# Altium schematic sheet 19.SchDoc
size 297 x 209 mm
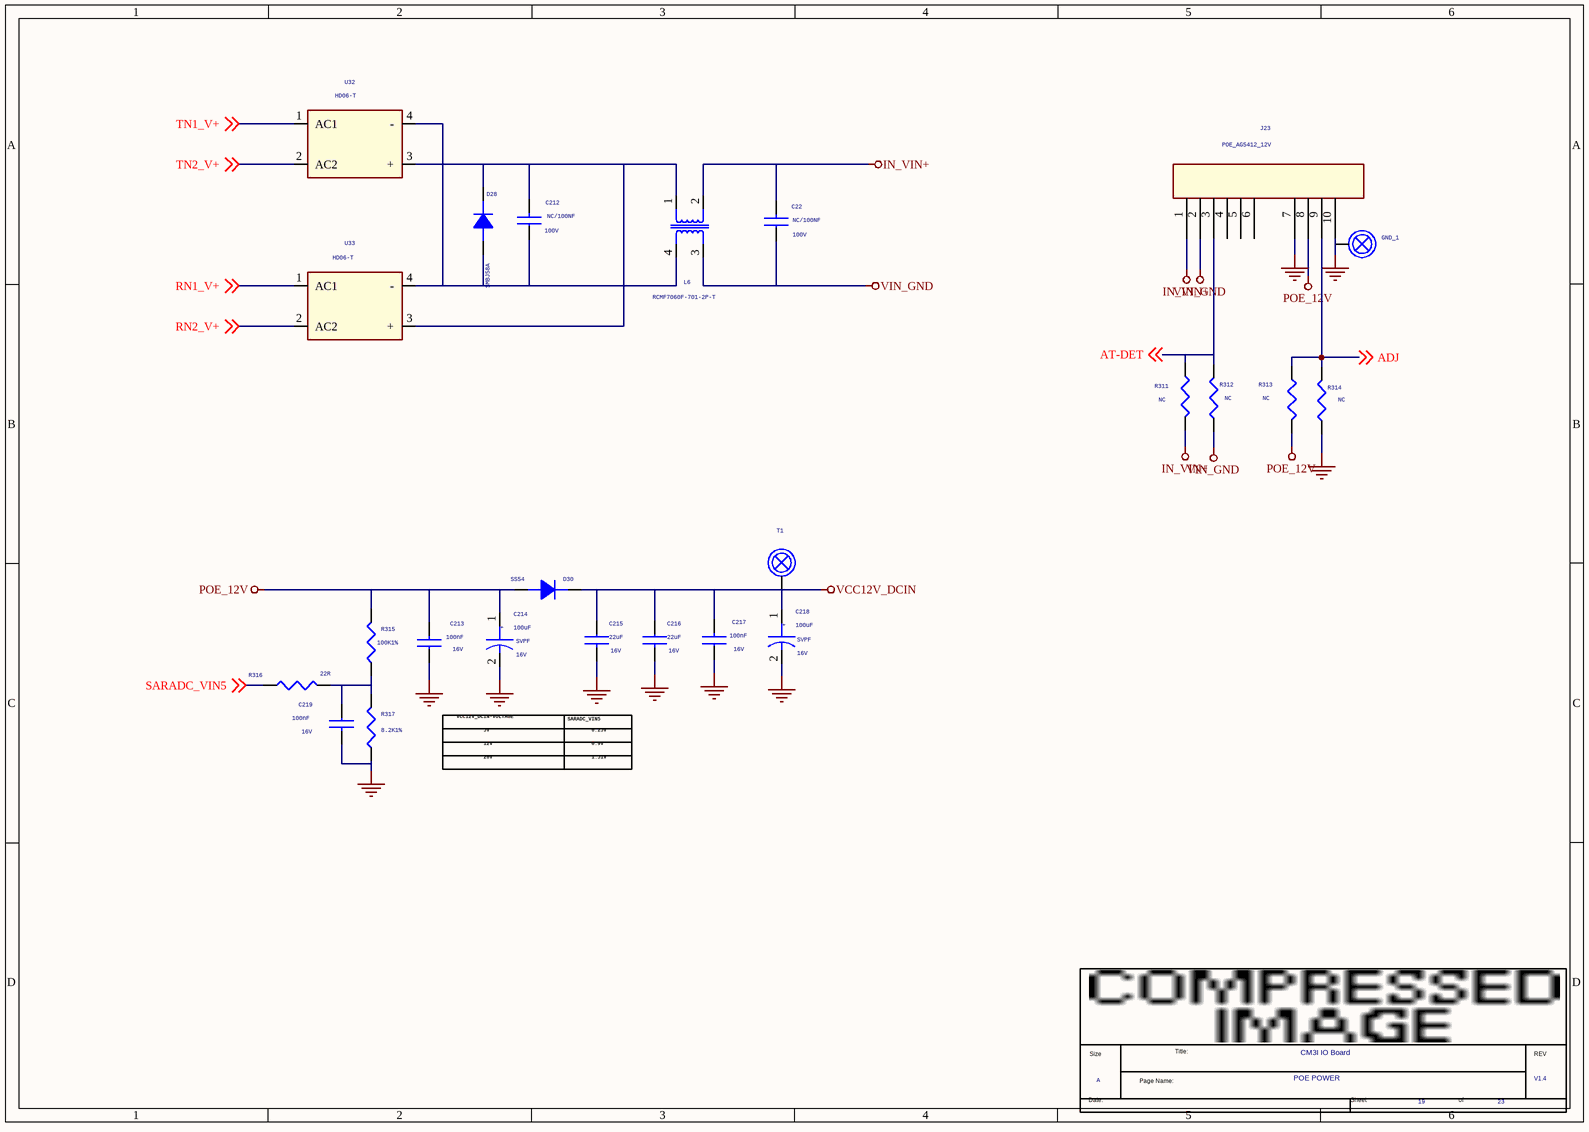
[diagram p0: 19.SchDoc]

## Parts
*  Page Count: 23  Page Number: 19  Page Size: A  Title: CM3I IO Board  RevCode: V1.4  Doc: POE POWER  (hidden comment: radxa_1010)  (graphical)
C22  NC/100NF  Voltage: 100V  [C0603]
C212  NC/100NF  Voltage: 100V  [C0603]
C213  100nF  Voltage: 16V  [C0402]
C214  100uF  Dielectric: SVPF  Voltage: 16V  [CAP_SM_6D3X7D7_1]
C215  22uF  Voltage: 16V  [C0805]
C216  22uF  Voltage: 16V  [C0805]
C217  100nF  Voltage: 16V  [C0402]
C218  100uF  Dielectric: SVPF  Voltage: 16V  [CAP_SM_6D3X7D7_1]
C219  100nF  Voltage: 16V  [C0402]
D28  SMBJ58A  [DO_214AA]
D30  SS54  [DO_214AC]
GND_1  GND  [TP32]  (value not drawn)
J23  POE_AG5412_12V  [DIP_POE_AG5412]
L6  RCMF7060F-701-2P-T  [RCMF7060]
R311  NC  [R0402]
R312  NC  [R0402]
R313  NC  [R0402]
R314  NC  [R0402]
R315  100K1%  [R0402]
R316  22R  [R0402]
R317  8.2K1%  [R0402]
T1  12V  [TP32]  (value not drawn)
U32  HD06-T  [SOP4_1D27_4]
U33  HD06-T  [SOP4_1D27_4]

## Nets
GND: C213.1 C214.2 C215.2 C216.2 C217.1 C218.2 C219.2 GND_1.1 J23.7(-VDC) J23.10(-VDC) R314.2 R317.1
IN_VIN+: C22.2 J23.1(VIN+) L6.2(R4) R311.2
POE_12V: C213.2 C214.1 D30.1(A) J23.8(+VDC) R313.2 R315.2
VCC12V_DCIN: C215.1 C216.1 C217.2 C218.1 D30.2(K) T1.1
VIN_GND: C22.1 J23.2(VIN-) L6.3(R3) R312.2
ADJ: J23.9(ADJ) R313.1 R314.1 ; off-sheet ADJ
AT-DET: J23.3(AT-DET) R311.1 R312.1 ; off-sheet AT-DET
RN1_V+: U33.1(AC1) ; off-sheet RN1_V+
RN2_V+: U33.2(AC2) ; off-sheet RN2_V+
SARADC_VIN5: R316.1 ; off-sheet SARADC_VIN5
TN1_V+: U32.1(AC1) ; off-sheet TN1_V+
TN2_V+: U32.2(AC2) ; off-sheet TN2_V+
NetC212_1: C212.1 D28.1(ANODE) L6.4(R2) U32.4(-) U33.4(-)
NetC212_2: C212.2 D28.2(CATHODE) L6.1(R1) U32.3(+) U33.3(+)
NetC219_1: C219.1 R315.1 R316.2 R317.2

Not connected (* = marked no-connect by the designer): J23 4 5 6

## Notes on the sheet
- VCC12V_DCIN-VOLTAGE
- 5V
- 12V
- SARADC_VIN5
- 0.25V
- 0.9V
- 20V
- 1.51V
- (in symbol CAP) +
- (in symbol radxa_1010) Title:; Size; REV; Page Name:; Date:; Sheet; of

## Library data of the parts
C22 = CAP NP_0: cap,10.00uF,+/-10%,6.3V,X5R,C0603; Manufacturer: TDK; RK PN: C1608X5R0J106K080AB; Priority: A; Tolerance: 10%; Dielectric: X5R; Part Type: C0402; Manufacturer PN: C1608X5R0J106K080AB; Created by: JJJ
C212 = CAP NP_0: cap,10.00uF,+/-10%,6.3V,X5R,C0603; Manufacturer PN: C1608X5R0J106K080AB; Manufacturer: TDK; Tolerance: 10%; Priority: A; Dielectric: X5R; Created by: JJJ; Part Type: C0402; RK PN: C1608X5R0J106K080AB
C213 = CAP NP_0: cap,1.00uF,+/-10%,10V,X5R,C0402; Manufacturer: TDK; RK PN: C1005X5R1A105K050BB; Priority: A; Tolerance: 10%; Dielectric: X5R; Part Type: C0402; Manufacturer PN: C1005X5R1A105K050BB; Created by: JJJ
C214 = CAP: 47uF,25V,30mR,SVPF; Manufacturer: Panasonic; RK PN: 25SVPF47M; Priority: A; Tolerance: 20%; Part Type: CAP_SM_6D3X7D7_1; Manufacturer PN: 25SVPF47M; Created by: JJJ
C215 = CAP NP_0: cap,22.00uF,+/-10%,10V,X5R,C0805; Manufacturer PN: C2012X5R1A226K125AB; Manufacturer: TDK; Tolerance: 10%; Priority: A; Dielectric: X5R; Created by: JJJ; Part Type: C0805; RK PN: C2012X5R1A226K125AB
C216 = CAP NP_0: cap,22.00uF,+/-10%,10V,X5R,C0805; Manufacturer: TDK; RK PN: C2012X5R1A226K125AB; Priority: A; Tolerance: 10%; Dielectric: X5R; Part Type: C0805; Manufacturer PN: C2012X5R1A226K125AB; Created by: JJJ
C217 = CAP NP_0: cap,1.00uF,+/-10%,10V,X5R,C0402; Manufacturer PN: C1005X5R1A105K050BB; Manufacturer: TDK; Tolerance: 10%; Priority: A; Dielectric: X5R; Created by: JJJ; Part Type: C0402; RK PN: C1005X5R1A105K050BB
C218 = CAP: 47uF,25V,30mR,SVPF; Manufacturer PN: 25SVPF47M; Manufacturer: Panasonic; Tolerance: 20%; Priority: A; Created by: JJJ; Part Type: CAP_SM_6D3X7D7_1; RK PN: 25SVPF47M
C219 = CAP NP_0: cap,100.00nF,+/-10%,16V,X5R,C0402; Manufacturer PN: C1005X5R1C104K050BA; Manufacturer: TDK; Tolerance: 10%; Priority: A; Dielectric: X5R; Created by: JJJ; Part Type: C0402; RK PN: C1005X5R1C104K050BA
D28 = DIODE_1: 贴片TVS管 SMBJ58A 58V 6.5A SMB 君耀; Part Number: 911110000068; Approved: 已承认; Grade: B; Part Type: 二极管
D30 = DIODE_Dup1: Schottky Barrier，SS32 DO214AC; Manufacturer: 星海; ROOM: CHG; RK PN: SS32; Priority: A; Part Type: Schottky rectifier; Manufacturer PN: SS32; Created by: JJJ
GND_1 T1 = TEST: 测试点-电源; Part Type: 测试点
J23 = CON4_1
L6 = R-PACK4_1
R311 = RESISTOR_0_Dup1: 通用厚膜电阻,47K,+/-5%,R0402,1/16W.; Manufacturer PN: RC0402JR-0747KL; Manufacturer: YAGEO; Tolerance: 5%; Wattage: 1/16W; Priority: A; Created by: YTL; Part Type: 通用厚膜电阻; RK PN: RC0402JR-0747KL
R312-R314 = RESISTOR_0_Dup1: 通用厚膜电阻,47K,+/-5%,R0402,1/16W.; Manufacturer: YAGEO; Tolerance: 5%; RK PN: RC0402JR-0747KL; Priority: A; Wattage: 1/16W; Part Type: 通用厚膜电阻; Manufacturer PN: RC0402JR-0747KL; Created by: YTL
R315 R317 = RESISTOR_2_Dup1: 通用厚膜电阻,10K,+/-5%,R0402,1/16W.; Manufacturer: YAGEO; Tolerance: 5%; RK PN: RC0402JR-0710KL; Priority: A; Wattage: 1/16W; Part Type: 通用厚膜电阻; Manufacturer PN: RC0402JR-0710KL; Created by: YTL
R316 = RESISTOR_2_Dup1: 通用厚膜电阻,10K,+/-5%,R0402,1/16W.; Manufacturer PN: RC0402JR-0710KL; Manufacturer: YAGEO; Tolerance: 5%; Wattage: 1/16W; Priority: A; Created by: YTL; Part Type: 通用厚膜电阻; RK PN: RC0402JR-0710KL
U32 = RECTIFIER_B: 贴片整流桥 DI2010S 1000V 2A SDIP 4Pin PANJIT; Part Number: 911130000003; Approved: 未承认; Grade: B; Part Type: 二极管
U33 = RECTIFIER_B: 贴片整流桥 DI2010S 1000V 2A SDIP 4Pin PANJIT; Part Number: 911130000003; Grade: B; Approved: 未承认; Part Type: 二极管
* = radxa_1010: Page Create Date: March  8, 1995